# EasyEDA Pro project V3P驱动板最新版原PCB.epro

# Board V3pro_PCB_4.0
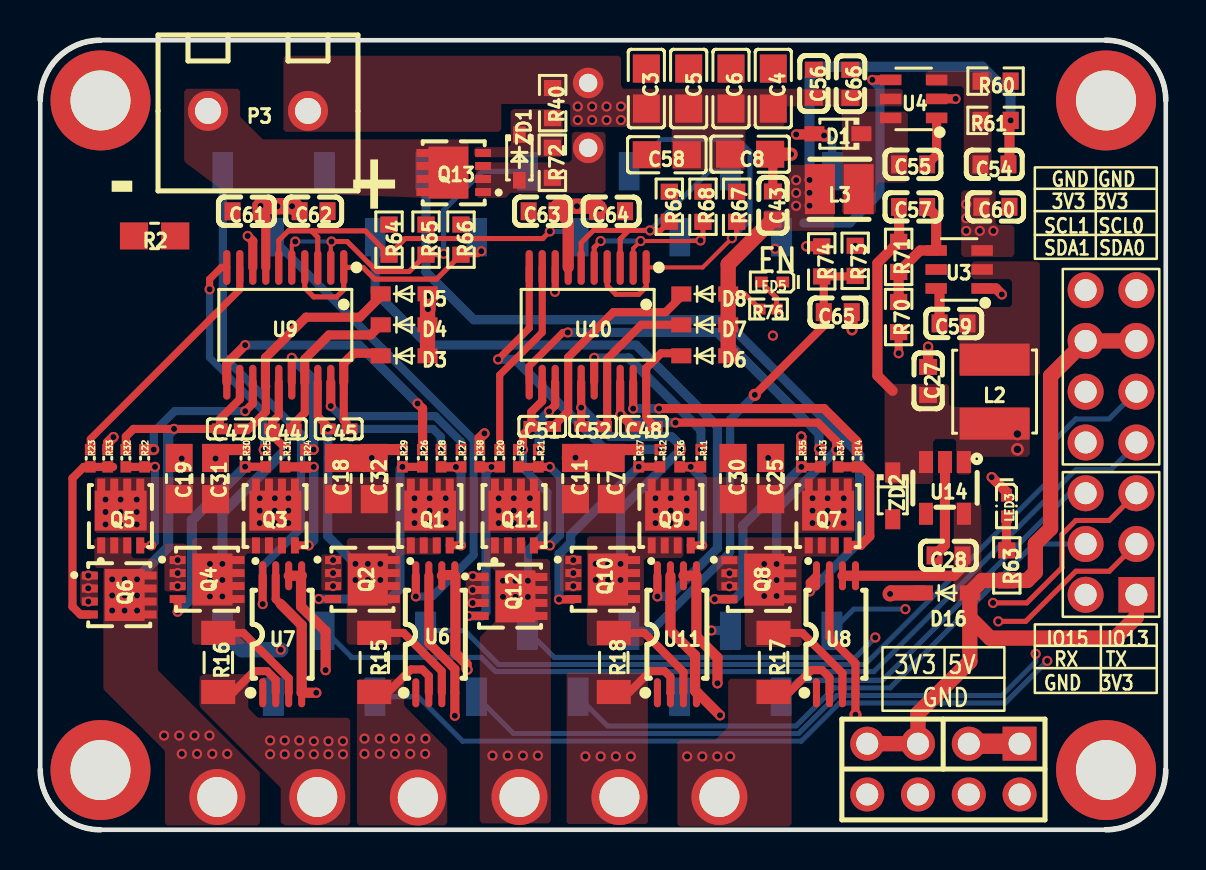
[diagram p0: board, top side]
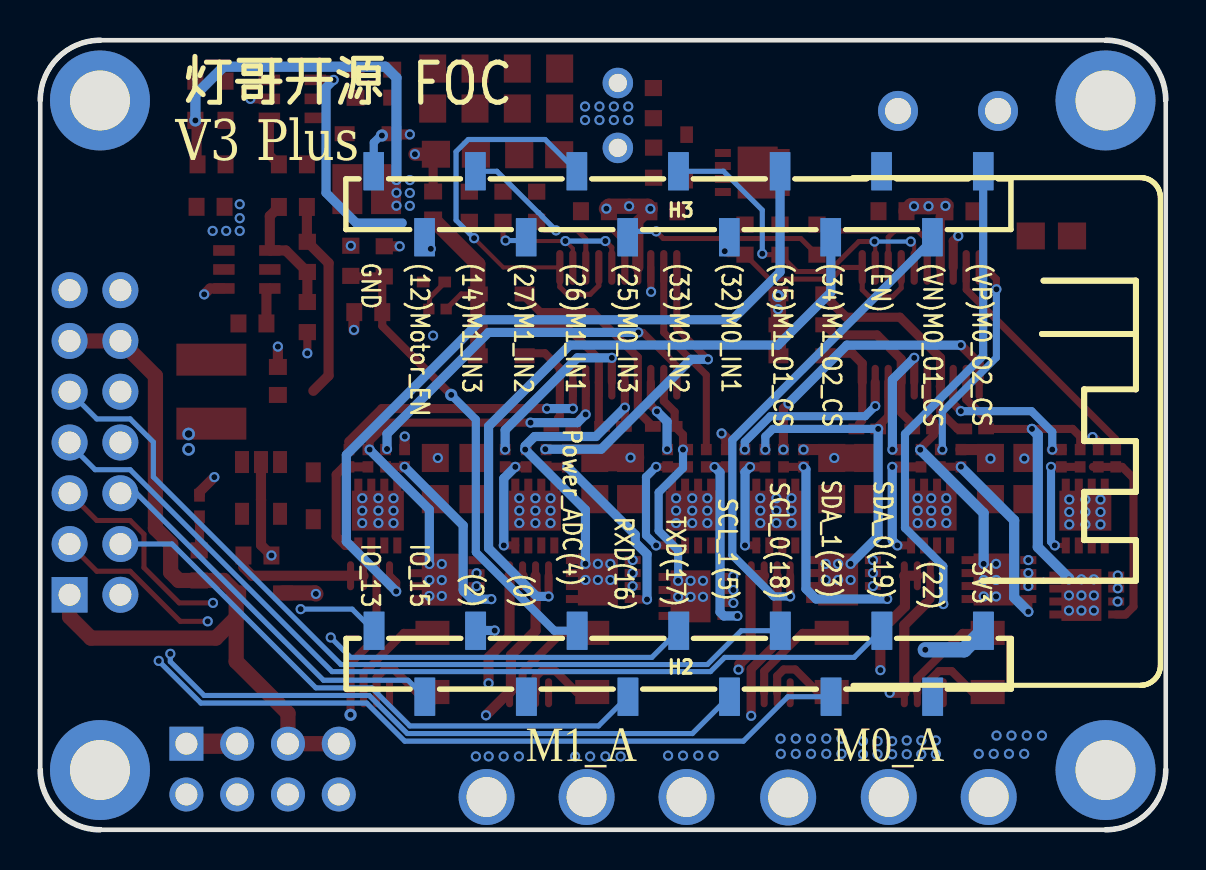
[diagram p1: board, bottom side, seen from below]

Outline 56.32 x 39.52 mm; copper layers: Top Layer, 内层1, 内层2, Bottom Layer. Coordinates in mm from the lower left corner of the outline.
Outline path: 0,36.52 arc(0.88,38.64) 3,39.52 53.29,39.52 arc(55.42,38.64) 56.29,36.52 56.29,3.03 arc(55.42,0.9) 53.29,0.03 3,0.03 arc(0.88,0.9) 0,3.03 0,36.52 ; 0.03,36.5 arc(0.9,38.62) 3.03,39.5 53.32,39.5 arc(55.44,38.62) 56.32,36.5 56.32,3 arc(55.44,0.88) 53.32,0 3.03,0 arc(0.9,0.88) 0.03,3 0.03,36.5
Stack: Top Layer 0.035mm 外层铜厚1oz / Dielectric1 0.2104mm 7628 RC49% 8.6mil / 内层1 0.035mm / Dielectric2 1.065mm 1.1mm H/HOZ Copper / 内层2 0.035mm / Dielectric3 0.2104mm 7628 RC49% 8.6mil / Bottom Layer 0.035mm 外层铜厚1oz

## Design rules (mm)
template: JLCPCB Capability(Two Layers Board)
spacing copperThickness1oz (default): track to track 0.102, other pairs 0.152 to 0.3
spacing copperThickness2oz: track to track 0.203, other pairs 0.152 to 0.3
track width copperThickness1oz (default): min 0.127, default 0.254, max 2.54
track width copperThickness2oz: min 0.203, default 0.254, max 2.54
differential pair differentialPair (default): width min 0.127, default 0.254, max 2.54; gap min 0.152, default 0.152
via viaSize (default): diameter min 0.5, default 0.61, max 10; hole min 0.3, default 0.305, max 6.3

## Placement (name value [footprint] x y rotation side)
C3  4.7uF  [C0805]  30.33 37.09 90 top
C4  4.7uF  [C0805]  36.68 37.09 90 top
C5  4.7uF  [C0805]  32.44 37.09 90 top
C6  4.7uF  [C0805]  34.56 37.09 90 top
C7  10uF  [0805]  28.57 17.58 270 top
C8  4.7uF  [C0805]  35.52 33.81 0 top
C11  10uF  [0805]  26.78 17.58 270 top
C18  10uF  [0805]  14.92 17.58 270 top
C19  10uF  [0805]  6.96 17.58 270 top
C25  10uF  [0805]  36.55 17.58 270 top
C27  10uF  [C0603]  44.42 22.47 270 top
C28  1uF  [C0603]  45.44 13.73 0 top
C30  10uF  [0805]  34.67 17.58 270 top
C31  10uF  [0805]  8.78 17.58 270 top
C32  10uF  [0805]  16.72 17.58 270 top
C43  10uF  [C0603]  36.66 31.24 270 top
C44  1uF  [C0402]  12.15 20.07 180 top
C45  1uF  [C0402]  14.94 20.07 180 top
C47  1uF  [C0402]  9.54 20.07 180 top
C48  1uF  [C0402]  30.2 20.19 180 top
C51  1uF  [C0402]  25.12 20.19 180 top
C52  1uF  [C0402]  27.66 20.19 180 top
C54  47pf  [C0603]  47.74 33.3 0 top
C55  100nF  [C0603]  43.67 33.3 0 top
C56  100nF  [C0603]  38.7 37.34 270 top
C57  47pf  [C0603]  43.67 31.17 0 top
C58  4.7uF  [C0805]  31.35 33.78 180 top
C59  100nF  [C0603]  45.69 25.34 180 top
C60  100nF  [C0603]  47.79 31.18 180 top
C61  100nF  [C0603]  10.33 30.95 0 top
C62  1uf  [C0603]  13.68 30.96 180 top
C63  100nF  [C0603]  25.14 30.95 0 top
C64  1 uf  [C0603]  28.56 30.96 180 top
C65  100nF  [C0603]  39.9 25.91 180 top
C66  1uf  [C0603]  40.53 37.33 270 top
D1  1N5819WS  [SOD-323_L1.8-W1.3-LS2.5-RD]  39.91 34.83 180 top
D3  1N5819WS  [SOD-323_L1.8-W1.3-LS2.5-RD]  18.21 23.72 0 top
D4  1N5819WS  [SOD-323_L1.8-W1.3-LS2.5-RD]  18.21 25.27 0 top
D5  1N5819WS  [SOD-323_L1.8-W1.3-LS2.5-RD]  18.21 26.82 0 top
D6  1N5819WS  [SOD-323_L1.8-W1.3-LS2.5-RD]  33.25 23.72 0 top
D7  1N5819WS  [SOD-323_L1.8-W1.3-LS2.5-RD]  33.25 25.27 0 top
D8  1N5819WS  [SOD-323_L1.8-W1.3-LS2.5-RD]  33.25 26.82 0 top
D16  1N5819WS  [SOD-323_L1.8-W1.3-LS2.5-RD]  45.33 11.86 0 top
H2  -  [SMD,P=2.54mm(交错脚)]  25.63 8.38 270 bottom
H3  -  [SMD,P=2.54mm(交错脚)]  25.65 31.37 270 bottom
L2  10uH  [IND-SMD_L4.0-W4.0]  47.75 21.93 270 top
L3  6.8uH  [IND-SMD_L2.5-W2.0_SPH252012]  39.98 32.06 180 top
LED3  TZ-P2-0402GTIA1-0.45T  [LED0402-RD]  48.34 16.21 270 top
LED5  TZ-P2-0402GTIA1-0.45T  [LED0402-RD]  36.62 27.41 180 top
NOREF  -  [Pad_e349]  52.3 27.01 0 top
NOREF#2  -  [Pad_e383]  49 1.78 0 top
NOREF#3  -  [Pad_e2956]  23.98 1.65 180 top
NOREF#4  -  [Pad_e352]  52.3 24.47 0 top
NOREF#5  -  [Pad_e2952]  8.87 1.65 180 top
NOREF#6  -  [Pad_e360]  52.3 14.31 0 top
NOREF#7  -  [Pad_e369]  41.38 4.32 0 top
NOREF#8  -  [Pad_e2950]  3.03 36.5 270 top
NOREF#9  -  [Pad_e357]  54.84 19.39 0 top
NOREF#10  -  [Pad_e43]  27.42 34.12 0 top
NOREF#11  -  [Pad_e386]  49 4.32 0 top
NOREF#12  -  [Pad_e359]  54.84 16.85 0 top
NOREF#13  -  [Pad_e365]  54.84 11.77 90 top
NOREF#14  -  [Pad_e354]  52.3 21.93 0 top
NOREF#15  -  [Pad_e17]  27.42 37.37 0 top
NOREF#16  -  [Pad_e350]  54.84 27.01 0 top
NOREF#17  -  [Pad_e358]  52.3 16.85 0 top
NOREF#18  -  [Pad_e361]  54.84 14.31 0 top
NOREF#19  -  [Pad_e2959]  33.98 1.65 180 top
NOREF#20  -  [Pad_e2951]  3.03 3 270 top
NOREF#21  -  [Pad_e356]  52.3 19.39 0 top
NOREF#22  -  [Pad_e2953]  13.87 1.65 180 top
NOREF#23  -  [Pad_e374]  46.46 4.32 0 top
NOREF#24  -  [Pad_e373]  43.92 4.32 0 top
NOREF#25  -  [Pad_e382]  46.46 1.78 0 top
NOREF#26  -  [Pad_e362]  52.3 11.77 0 top
NOREF#27  -  [Pad_e355]  54.84 21.93 0 top
NOREF#28  -  [Pad_e2960]  53.32 36.5 270 top
NOREF#29  -  [Pad_e375]  41.38 1.78 0 top
NOREF#30  -  [Pad_e353]  54.84 24.47 0 top
NOREF#31  -  [Pad_e381]  43.92 1.78 0 top
NOREF#32  -  [Pad_e2958]  28.98 1.65 180 top
NOREF#33  -  [Pad_e1459]  18.9 1.63 180 top
NOREF#34  -  [Pad_e2961]  53.32 3 270 top
P3  WJ126V-5.0-2P  [CONN-TH_WJ126V-5.0-2P]  10.9 35.97 270 top
Q1  WSD4070DN  [PDFN3333-8_L3.1-W3.2-P0.65-LS3.4-BL]  19.52 15.71 0 top
Q2  WSD4070DN  [PDFN3333-8_L3.1-W3.2-P0.65-LS3.4-BL]  16.13 12.53 270 top
Q3  WSD4070DN  [PDFN3333-8_L3.1-W3.2-P0.65-LS3.4-BL]  11.78 15.71 0 top
Q4  WSD4070DN  [PDFN3333-8_L3.1-W3.2-P0.65-LS3.4-BL]  8.36 12.53 270 top
Q5  WSD4070DN  [PDFN3333-8_L3.1-W3.2-P0.65-LS3.4-BL]  4.04 15.71 0 top
Q6  WSD4070DN  [PDFN3333-8_L3.1-W3.2-P0.65-LS3.4-BL]  3.96 11.76 270 top
Q7  WSD4070DN  [PDFN3333-8_L3.1-W3.2-P0.65-LS3.4-BL]  39.42 15.71 0 top
Q8  WSD4070DN  [PDFN3333-8_L3.1-W3.2-P0.65-LS3.4-BL]  35.95 12.52 270 top
Q9  WSD4070DN  [PDFN3333-8_L3.1-W3.2-P0.65-LS3.4-BL]  31.57 15.71 0 top
Q10  WSD4070DN  [PDFN3333-8_L3.1-W3.2-P0.65-LS3.4-BL]  28.15 12.53 270 top
Q11  WSD4070DN  [PDFN3333-8_L3.1-W3.2-P0.65-LS3.4-BL]  23.73 15.71 0 top
Q12  WSD4070DN  [PDFN3333-8_L3.1-W3.2-P0.65-LS3.4-BL]  23.51 11.68 270 top
Q13  WSD4070DN  [PDFN3333-8_L3.1-W3.2-P0.65-LS3.4-BL]  20.69 32.89 90 top
R2  0  [0805]  5.73 29.72 0 top
R11  2.2Ω  [0402]  33.05 18.6 270 top
R12  2.2Ω  [0402]  31 18.6 270 top
R13  2.2Ω  [0402]  39.03 18.6 270 top
R14  2.2Ω  [0402]  40.87 18.6 270 top
R15  0.01  [R1206]  16.72 8.38 270 top
R16  0.01  [R1206]  8.92 8.38 270 top
R17  0.01  [R1206]  36.69 8.38 270 top
R18  0.01  [R1206]  28.7 8.38 270 top
R20  2.2Ω  [0402]  22.99 18.6 270 top
R21  2.2Ω  [0402]  24.93 18.6 270 top
R22  2.2Ω  [0402]  5.23 18.6 270 top
R23  2.2Ω  [0402]  2.51 18.6 270 top
R24  2.2Ω  [0402]  13.28 18.59 270 top
R25  2.2Ω  [0402]  11.29 18.6 270 top
R26  2.2Ω  [0402]  19.13 18.6 270 top
R27  2.2Ω  [0402]  21.06 18.6 270 top
R28  10kΩ  [R0402]  20.06 18.6 90 top
R29  10kΩ  [R0402]  18.13 18.6 90 top
R30  10kΩ  [R0402]  10.26 18.6 90 top
R31  10kΩ  [R0402]  12.25 18.6 90 top
R32  10kΩ  [R0402]  4.29 18.6 90 top
R33  10kΩ  [R0402]  3.39 18.6 90 top
R34  10kΩ  [R0402]  39.92 18.6 90 top
R35  10kΩ  [R0402]  38.08 18.6 90 top
R36  10kΩ  [R0402]  32 18.6 90 top
R37  10kΩ  [R0402]  29.95 18.6 90 top
R38  10kΩ  [R0402]  21.99 18.6 90 top
R39  10kΩ  [R0402]  23.93 18.6 90 top
R40  1k  [R0603]  25.64 36.36 90 top
R60  10K  [R0603]  47.79 37.47 180 top
R61  120K  [R0603]  47.79 35.5 0 top
R63  1K  [R0603]  48.36 13.24 90 top
R64  10K  [R0603]  17.46 29.53 90 top
R65  10K  [R0603]  19.31 29.53 90 top
R66  10K  [R0603]  21.06 29.53 90 top
R67  10K  [R0603]  34.84 31.18 90 top
R68  10K  [R0603]  33.16 31.18 90 top
R69  10K  [R0603]  31.47 31.18 90 top
R70  10K  [R0603]  42.95 25.66 270 top
R71  75K  [R0603]  42.95 28.67 270 top
R72  10K  [R0603]  25.63 33.38 90 top
R73  100K  [R0603]  40.77 28.47 90 top
R74  10K  [R0603]  39.1 28.45 270 top
R76  10kΩ  [R0402]  36.44 26.06 0 top
U2  micropython esp32  [MICROPYTHON ESP32]  25.65 19.81 270 bottom
U3  TPS54302DDCR  [SOT-23-6_L2.9-W1.6-P0.95-LS2.8-BL]  45.97 28.04 90 top
U4  BL9342  [SOT-23-6_L2.9-W1.6-P0.95-LS2.8-BL]  43.7 36.58 90 top
U6  INA240A2PWR  [TSSOP-8_L4.4-W3.0-P0.65-LS6.4-BL]  19.77 9.79 0 top
U7  INA240A2PWR  [TSSOP-8_L4.4-W3.0-P0.65-LS6.4-BL]  12.11 9.79 0 top
U8  INA240A2PWR  [TSSOP-8_L4.4-W3.0-P0.65-LS6.4-BL]  39.81 9.79 0 top
U9  FD6287T  [TSSOP-20_L6.5-W4.4-P0.65-LS6.4-BL]  12.27 25.27 180 top
U10  FD6287T  [TSSOP-20_L6.5-W4.4-P0.65-LS6.4-BL]  27.39 25.27 180 top
U11  INA240A2PWR  [TSSOP-8_L4.4-W3.0-P0.65-LS6.4-BL]  31.86 9.79 0 top
U14  XC6210B332MR  [TSOT-23-5_L2.9-W1.6-P0.95-LS2.8-BR]  45.26 17.11 90 top
ZD1  BZT52C12S  [SOD-323_L1.7-W1.3-LS2.6-RD]  23.98 33.65 270 top
ZD2  BZT52C5V6S  [SOD-323_L1.8-W1.3-LS2.5-RD]  42.65 16.72 270 top

## Footprints (pads in the part's own frame, mm; a bottom-side part is the same pattern mirrored in y, then rotated)
0402
  rect 0.566x0.54 smd: 1(-0.433,0) 2(0.433,0)
0805
  rect 1.41x1.35 smd: 1(-1.03,0) 2(1.03,0)
C0402
  rect 0.79x0.54 smd: 1(-0.545,0) 2(0.545,0)
C0603
  rect 0.8x0.9 smd: 1(-0.7,0) 2(0.7,0)
C0805
  rect 1.41x1.35 smd: 1(-1,0) 2(1,0)
CONN-TH_WJ126V-5.0-2P
  round 2 hole 1.3: 1(0,2.501) 2(0,-2.501)
IND-SMD_L2.5-W2.0_SPH252012
  rect 1.5x2.5 smd: 1(-0.969,0) 2(0.969,0)
IND-SMD_L4.0-W4.0
  rect 1.6x3.5 smd: 1(-1.6,0) 2(1.6,0)
LED0402-RD
  rect 0.636x0.54 smd: 1(-0.538,0) 2(0.538,0)
MICROPYTHON ESP32
  rect 1.9x1.02 smd: 1(-13.143,16.51) 2(-9.844,13.97) 3(-13.143,11.43) 4(-9.844,8.89) 5(-13.143,6.35) 6(-9.844,3.81) 7(-13.143,1.27) 8(-9.844,-1.27) 9(-13.143,-3.81) 10(-9.844,-6.35) 11(-13.143,-8.89) 12(-9.844,-11.43) 13(-13.143,-13.97) 14(9.844,16.51) 15(13.143,13.97) 16(9.844,11.43) 17(13.143,8.89) 18(9.844,6.35) 19(13.143,3.81) 20(9.844,1.27) 21(13.143,-1.27) 22(9.844,-3.81) 23(13.143,-6.35) 24(9.844,-8.89) 25(13.143,-11.43) 26(9.844,-13.97)
Pad_e17
  round 1.524 hole 0.914: 1(0,0)
Pad_e43
  round 1.524 hole 0.914: 1(0,0)
Pad_e349
  round 1.8 hole 1.1: 1(0,0)
Pad_e350
  round 1.8 hole 1.1: 2(0,0)
Pad_e352
  round 1.8 hole 1.1: 3(0,0)
Pad_e353
  round 1.8 hole 1.1: 4(0,0)
Pad_e354
  round 1.8 hole 1.1: 5(0,0)
Pad_e355
  round 1.8 hole 1.1: 6(0,0)
Pad_e356
  round 1.8 hole 1.1: 7(0,0)
Pad_e357
  round 1.8 hole 1.1: 8(0,0)
Pad_e358
  round 1.8 hole 1.1: 9(0,0)
Pad_e359
  round 1.8 hole 1.1: 10(0,0)
Pad_e360
  round 1.8 hole 1.1: 11(0,0)
Pad_e361
  round 1.8 hole 1.1: 12(0,0)
Pad_e362
  round 1.8 hole 1.1: 13(0,0)
Pad_e365
  rect 1.778x1.8 hole 1.1: 1(0,0)
Pad_e369
  round 1.7 hole 1.1: 1(0,0)
Pad_e373
  round 1.7 hole 1.1: 2(0,0)
Pad_e374
  round 1.7 hole 1.1: 3(0,0)
Pad_e375
  round 1.7 hole 1.1: 4(0,0)
Pad_e381
  round 1.7 hole 1.1: 5(0,0)
Pad_e382
  round 1.7 hole 1.1: 6(0,0)
Pad_e383
  round 1.7 hole 1.1: 7(0,0)
Pad_e386
  rect 1.7x1.7 hole 1.1: 1(0,0)
Pad_e1459
  round 2.8 hole 2: 1(0,0)
Pad_e2950
  round 5 hole 3: N(0,0)
Pad_e2951
  round 5 hole 3: N(0,0)
Pad_e2952
  round 2.8 hole 2: 1(0,0)
Pad_e2953
  round 2.8 hole 2: 1(0,0)
Pad_e2956
  round 2.8 hole 2: 1(0,0)
Pad_e2958
  round 2.8 hole 2: 1(0,0)
Pad_e2959
  round 2.8 hole 2: 1(0,0)
Pad_e2960
  round 5 hole 3: N(0,0)
Pad_e2961
  round 5 hole 3: N(0,0)
PDFN3333-8_L3.1-W3.2-P0.65-LS3.4-BL
  rect 0.4x0.8 smd: 1(-0.975,-1.47) 2(-0.325,-1.47) 3(0.325,-1.47) 4(0.975,-1.47) 5(0.975,1.47) 6(0.325,1.47) 7(-0.325,1.47) 8(-0.975,1.47)
  rect 2.6x2 smd: 9(-0.004,0.27)
R0402
  rect 0.566x0.54 smd: 1(-0.433,0) 2(0.433,0)
R0603
  rect 0.806x0.864 smd: 1(-0.753,0) 2(0.753,0)
R1206
  rect 1.208x1.701 smd: 1(-1.479,0) 2(1.479,0)
SMD,P=2.54mm(交错脚)
  rect 1.9x1.02 smd: 1(-1.587,16.51) 2(1.714,13.97) 3(-1.587,11.43) 4(1.714,8.89) 5(-1.587,6.35) 6(1.714,3.81) 7(-1.587,1.27) 8(1.714,-1.27) 9(-1.587,-3.81) 10(1.714,-6.35) 11(-1.587,-8.89) 12(1.714,-11.43) 13(-1.587,-13.97)
SOD-323_L1.7-W1.3-LS2.6-RD
  rect 0.83x0.63 smd: 1(-1.14,0) 2(1.14,0)
SOD-323_L1.8-W1.3-LS2.5-RD
  rect 1x0.75 smd: 1(-1.173,0) 2(1.173,0)
SOT-23-6_L2.9-W1.6-P0.95-LS2.8-BL
  rect 0.532x1.072 smd: 1(-0.95,-1.149) 2(0,-1.149) 3(0.95,-1.149) 4(0.95,1.149) 5(0,1.149) 6(-0.95,1.149)
TSOT-23-5_L2.9-W1.6-P0.95-LS2.8-BR
  rect 1.1x0.7 smd: 1(1.294,-0.951) 2(1.294,-0.001) 3(1.294,0.951) 4(-1.294,0.951) 5(-1.294,-0.949)
TSSOP-8_L4.4-W3.0-P0.65-LS6.4-BL
  oval 0.353x1.454 smd: 1(-0.975,-2.927) 2(-0.325,-2.927) 3(0.325,-2.927) 4(0.975,-2.927) 5(0.975,2.927) 6(0.325,2.927) 7(-0.325,2.927) 8(-0.975,2.927)
TSSOP-20_L6.5-W4.4-P0.65-LS6.4-BL
  oval 0.364x1.742 smd: 1(-2.925,-2.871) 2(-2.275,-2.871) 3(-1.625,-2.871) 4(-0.975,-2.871) 5(-0.325,-2.871) 6(0.325,-2.871) 7(0.975,-2.871) 8(1.625,-2.871) 9(2.275,-2.871) 10(2.925,-2.871) 11(2.925,2.871) 12(2.275,2.871) 13(1.625,2.871) 14(0.975,2.871) 15(0.325,2.871) 16(-0.325,2.871) 17(-0.975,2.871) 18(-1.625,2.871) 19(-2.275,2.871) 20(-2.925,2.871)

## Nets
3V3: C28.2 D16.2 NOREF#4.3 NOREF#7.1 NOREF#13.1 NOREF#24.2 NOREF#30.4 R63.1 U6.5 U6.6 U7.5 U7.6 U8.5 U8.6 U11.5 U11.6 U14.5
5V: C27.2 C57.1 L2.2 NOREF#11.1 NOREF#23.3 R71.1 U14.1 U14.3 ZD2.1
10V: C43.2 C54.2 C61.2 C62.2 C63.2 C64.2 D3.2 D4.2 D5.2 D6.2 D7.2 D8.2 L3.2 R61.2 R76.1 U9.7 U10.7
GND: C3.2 C4.2 C5.2 C6.2 C8.2 C27.1 C28.1 C43.1 C56.1 C58.2 C60.1 C61.1 C62.1 C63.1 C64.1 C65.1 C66.1 D1.2 H3.13 LED3.1 LED5.1 NOREF.1 NOREF#2.7 NOREF#10.1 NOREF#16.2 NOREF#25.6 NOREF#26.13 NOREF#28.N NOREF#29.4 NOREF#31.5 NOREF#34.N Q13.1 Q13.2 Q13.3 R2.2 R60.1 R64.2 R65.2 R66.2 R67.2 R68.2 R69.2 R70.2 R72.1 R74.1 U2.13 U3.1 U4.2 U6.4 U6.7 U7.4 U7.7 U8.4 U8.7 U9.8 U10.8 U11.4 U11.7 U14.2 ZD1.2 ZD2.2
PGND: C7.1 C11.1 C18.1 C19.1 C25.1 C30.1 C31.1 C32.1 NOREF#8.N NOREF#20.N Q2.1 Q2.2 Q2.3 Q4.1 Q4.2 Q4.3 Q6.1 Q6.2 Q6.3 Q8.1 Q8.2 Q8.3 Q10.1 Q10.2 Q10.3 Q12.1 Q12.2 Q12.3 R2.1 R29.2 R30.2 R33.2 R35.2 R37.2 R38.2
VIN: C3.1 C4.1 C5.1 C6.1 C7.2 C8.1 C11.2 C18.2 C19.2 C25.2 C30.2 C31.2 C32.2 C56.2 C58.1 C60.2 C66.2 NOREF#15.1 P3.1 Q1.5 Q1.6 Q1.7 Q1.8 Q1.9 Q3.5 Q3.6 Q3.7 Q3.8 Q3.9 Q5.5 Q5.6 Q5.7 Q5.8 Q5.9 Q7.5 Q7.6 Q7.7 Q7.8 Q7.9 Q9.5 Q9.6 Q9.7 Q9.8 Q9.9 Q11.5 Q11.6 Q11.7 Q11.8 Q11.9 R40.2 R73.2 U3.3 U4.5
IO_13: H2.13 NOREF#12.10 U2.26
IO_15: H2.12 NOREF#17.9 U2.25
M0_GH1: R27.1 U9.19
M0_GH2: R24.1 U9.16
M0_GH3: R22.1 U9.13
M0_GL1: R26.1 U9.11
M0_GL2: R25.1 U9.10
M0_GL3: R23.1 U9.9
M0_IN1: H3.6 R66.1 U2.6 U9.1 U9.4
M0_IN2: H3.7 R65.1 U2.7 U9.2 U9.5
M0_IN3: H3.8 R64.1 U2.8 U9.3 U9.6
M0_OUT1_CS: H3.2 U2.2 U6.8
M0_OUT1_N: NOREF#33.1 R15.2 U6.2
M0_OUT1_P: C45.2 Q1.1 Q1.2 Q1.3 Q2.5 Q2.6 Q2.7 Q2.8 Q2.9 R15.1 R28.2 U6.3 U9.18
M0_OUT2_CS: H3.1 U2.1 U7.8
M0_OUT2_N: NOREF#22.1 R16.2 U7.2
M0_OUT2_P: C44.2 Q3.1 Q3.2 Q3.3 Q4.5 Q4.6 Q4.7 Q4.8 Q4.9 R16.1 R31.2 U7.3 U9.15
M0_OUT3: C47.2 NOREF#5.1 Q5.1 Q5.2 Q5.3 Q6.5 Q6.6 Q6.7 Q6.8 Q6.9 R32.2 U9.12
M1_GH1: R14.1 U10.19
M1_GH2: R11.1 U10.16
M1_GH3: R21.1 U10.13
M1_GL1: R13.1 U10.11
M1_GL2: R12.1 U10.10
M1_GL3: R20.1 U10.9
M1_IN1: H3.9 R67.1 U2.9 U10.1 U10.4
M1_IN2: H3.10 R68.1 U2.10 U10.2 U10.5
M1_IN3: H3.11 R69.1 U2.11 U10.3 U10.6
M1_OUT1_CS: H3.5 U2.5 U8.8
M1_OUT1_N: NOREF#19.1 R17.2 U8.2
M1_OUT1_P: C48.2 Q7.1 Q7.2 Q7.3 Q8.5 Q8.6 Q8.7 Q8.8 Q8.9 R17.1 R34.2 U8.3 U10.18
M1_OUT2_CS: H3.4 U2.4 U11.8
M1_OUT2_N: NOREF#32.1 R18.2 U11.2
M1_OUT2_P: C52.2 Q9.1 Q9.2 Q9.3 Q10.5 Q10.6 Q10.7 Q10.8 Q10.9 R18.1 R36.2 U10.15 U11.3
M1_OUT3: C51.2 NOREF#3.1 Q11.1 Q11.2 Q11.3 Q12.5 Q12.6 Q12.7 Q12.8 Q12.9 R39.2 U10.12
MOTOR_EN: H3.12 U2.12 U4.4
POWER_ADC: C65.2 H2.9 R73.1 R74.2 U2.22
RXD: H2.8 NOREF#6.11 U2.21
SCL_0: H2.5 NOREF#27.6 U2.18
SCL_1: H2.6 NOREF#14.5 U2.19
SDA_0: H2.3 NOREF#9.8 U2.16
SDA_1: H2.4 NOREF#21.7 U2.17
TXD: H2.7 NOREF#18.12 U2.20
$1N1813: Q7.4 R14.2 R34.1
$1N1814: Q8.4 R13.2 R35.1
$1N1815: Q9.4 R11.2 R36.1
$1N1816: Q10.4 R12.2 R37.1
$1N1817: Q12.4 R20.2 R38.1
$1N1818: Q11.4 R21.2 R39.1
$1N1819: Q6.4 R23.2 R33.1
$1N1820: Q5.4 R22.2 R32.1
$1N1821: Q4.4 R25.2 R30.1
$1N1822: Q3.4 R24.2 R31.1
$1N1823: Q2.4 R26.2 R29.1
$1N1824: Q1.4 R27.2 R28.1
$1N3545: Q13.4 R40.1 R72.2 ZD1.1
$1N3571: P3.2 Q13.5 Q13.6 Q13.7 Q13.8 Q13.9
$1N3819: C59.1 L2.1 U3.2
$1N3947: C59.2 U3.6
$1N4174: C57.2 R70.1 R71.2 U3.4
$1N4639: U3.5
$1N5187: C55.1 D1.1 L3.1 U4.6
$1N5204: C55.2 U4.1
$1N5456: C54.1 R60.2 R61.1 U4.3
$1N5899: LED3.2 R63.2
$1N6397: C44.1 D4.1 U9.17
$1N6400: C47.1 D5.1 U9.14
$1N6401: C45.1 D3.1 U9.20
$1N7278: C48.1 D6.1 U10.20
$1N7279: C51.1 D8.1 U10.14
$1N7282: C52.1 D7.1 U10.17
$1N41201: LED5.2 R76.2
$1N54448: D16.1 H2.1 U2.14

Pads without a net: H2 2 10 11; H3 3; U2 3 15 23 24; U6 1; U7 1; U8 1; U11 1; U14 4

## Via types
v1: diameter 0.508, hole 0.305, Top Layer to Bottom Layer, 283 vias
v2: diameter 0.61, hole 0.305, Top Layer to Bottom Layer, 5 vias
v3: diameter 0.635, hole 0.381, Top Layer to Bottom Layer, 2 vias

## Routing (per net, layer and track width the routed paths; a pad name or vN(x,y) marks a point on that pad's centre or on a via; arc(x,y) is an arc through that point)
3V3: length 93.7
  Top Layer w0.508: 20.1,12.72 20.13,12.75 20.71,12.75 20.78,12.69 20.78,8.85 21.33,8.3 21.33,8.07 v1(21.38,8.02) ; 32.18,12.72 32.83,12.72 32.83,9.69 33.88,8.64 v1(33.88,7.34) ; 40.14,12.72 45.71,12.72 46.14,13.15 C28.2 ; 12.44,12.72 13.09,12.72 13.06,12.69 13.06,11.18 14.29,9.95 v1(14.29,8)
  Top Layer w0.762: 43.92,5.84 46.51,8.43 46.51,10.62 ; NOREF#7.1 NOREF#24.2 43.92,5.84 ; 46.51,10.62 47.52,9.6 53.77,9.6 54.84,10.67 NOREF#13.1 ; 46.51,10.62 D16.2 47.13,12.48 R63.1 49.38,12.48 49.78,12.89 49.78,14.32 50.55,15.08 50.55,22.71 NOREF#4.3 NOREF#30.4
  内层1 w0.762: v1(14.29,8) 21.36,8 v1(21.38,8.02) 33.2,8.02 v1(33.88,7.34) 36.91,4.32 NOREF#7.1
5V: length 28.1
  Top Layer w0.508: 42.65,21.97 41.88,22.73 41.88,28.36 R71.1 ; 42.97,29.45 C57.1
  Top Layer w1.016: NOREF#23.3 NOREF#11.1
  内层1 w1.016: 49.12,4.32 48.89,4.55 v3(48.89,19.04) v3(48.89,19.81)
10V: length 48.2
  Top Layer w0.254: R76.1 35.25,26.82 D8.2
  Top Layer w0.457: U9.7 11.29,30.69 C61.2
  Top Layer w0.508: 48.49,33.27 48.49,35.31 48.55,35.36 v2(48.55,35.5)
  Top Layer w0.559: v1(25.79,31.08) 26.42,30.45 U10.7
  Top Layer w0.762: 34.42,23.85 D7.2 D8.2 34.42,28.31 C43.2 ; 19.38,23.85 D4.2 19.38,26.7 v2(19.41,26.72) v1(19.41,26.06) ; v1(25.79,31.08) 25.92,31.21 v1(26.85,31.21) 27.87,31.21 v1(27.99,31.08)
  Top Layer w0.813: v1(11.03,31.23) 11.05,31.21 v1(11.88,31.21) v1(12.6,31.21) 12.73,31.21 C62.2
  内层1 w0.762: v1(19.41,26.06) v2(19.41,26.72) 19.41,31.24
  Bottom Layer w0.508: v1(38.49,32.52) 38.49,37.63 39.05,38.19 47.13,38.19 48.55,36.77 v2(48.55,35.5)
  vias: v1(37.82,32.51) v1(37.82,31.87) v1(37.82,31.23) v1(38.49,31.88) v1(38.49,31.23)
GND: length 80.5
  Top Layer w0.355: 25.77,28.14 25.77,26.94 v1(25.76,26.92)
  Top Layer w0.406: 12.04,11.3 11.79,11.55 11.79,12.72 ; v1(42.95,23.85) R70.2 ; v2(40.79,5.77) U8.4 40.79,8.34 39.49,9.64 39.49,12.72
  Top Layer w0.457: v1(10.39,29.72) 10.64,29.46 U9.8 ; C43.1 36.66,33.76 36.68,33.78 ; 19.45,12.72 19.45,9.36 20.75,8.06 U6.4 v1(20.75,5.72) ; U4.2 v1(45.8,36.58)
  Top Layer w0.508: LED3.1 48.34,16.91 v1(47.6,17.65) ; D1.2 38.7,34.8 v1(37.82,34.8) ; 12.04,11.3 13.09,10.25 13.09,6.87 v1(13.82,6.87) ; 31.53,12.72 31.53,11.97 31.54,11.96 31.54,11.41 31.53,11.4 31.53,9.97 32.76,8.74 32.76,6.96 32.86,6.87 ; 32.86,6.87 32.88,6.87 v1(34.01,5.74) ; 32.86,6.87 U11.4 ; U3.1 47.81,27.09 v1(48.11,26.8) ; C27.1 v1(44.42,24.18) ; v1(44.74,13.73) 45.26,14.26 45.26,16.51 45.27,16.51 U14.2 ; R74.1 v1(38.33,29.2)
  Top Layer w0.559: v1(40.61,25.02) 40.61,25.89 40.6,25.91
  Top Layer w0.66: C8.2 v1(37.57,33.81)
  内层1 w0.762: v1(13.82,6.87) 14.97,5.72 v1(20.75,5.72) 20.77,5.74 v1(34.01,5.74) 37.97,1.78 NOREF#29.4
  Bottom Layer w0.406: H3.13 39.62,34.39 39.22,34.8
  vias: v1(36.66,24.73) v2(39.22,34.74)
PGND: length 10.7
  Top Layer w0.508: 21.99,19.03 21.99,19.6 v1(22.23,19.84) ; v1(3.67,19.66) 3.4,19.39 3.4,19.05 3.39,19.03 ; 38.08,19.03 38.08,19.68 v1(38.07,19.69)
  Top Layer w0.559: v1(18.13,19.03) 17.01,19.03 v1(16.59,18.61) ; 29.95,19.03 28.86,19.03 28.44,18.61 ; 10.26,19.03 9.23,19.03 v1(8.78,18.58)
  Top Layer w1.371: v1(26.78,18.63) 28.43,18.63 28.44,18.61 ; v1(16.59,18.61) C18.1
  vias: v1(2.41,12.73) v1(2.41,12.09) v1(2.42,11.43) v1(6.89,13.5) v1(6.89,12.85) v1(6.89,12.2) v1(7.09,18.58) v1(14.66,13.5) v1(14.66,12.85) v1(14.66,12.2) v1(21.65,12.7) v1(21.64,12.01) v1(21.64,11.36) v1(26.68,13.5) v1(26.68,12.85) v1(26.68,12.2) v1(34.48,12.85) v1(34.48,12.2) v1(36.42,18.61)
VIN:
  vias: v1(3.28,16.53) v1(3.28,15.91) v1(3.28,15.29) v1(4.03,16.53) v1(4.03,15.91) v1(4.03,15.29) v1(4.84,16.53) v1(4.84,15.91) v1(4.84,15.29) v1(10.99,16.6) v1(10.99,15.98) v1(10.99,15.35) v1(11.75,16.6) v1(11.75,15.98) v1(11.75,15.35) v1(12.42,16.6) v1(12.42,15.98) v1(12.42,15.35) v1(18.73,16.6) v1(18.73,15.98) v1(18.73,15.35) v1(19.49,16.6) v1(19.49,15.98) v1(19.49,15.35) v1(20.29,16.6) v1(20.29,15.98) v1(20.29,15.35) v1(22.94,16.6) v1(22.94,15.98) v1(22.94,15.35) v1(23.7,16.6) v1(23.7,15.98) v1(23.7,15.35) v1(24.5,16.6) v1(24.5,15.98) v1(24.5,15.35) v1(26.9,36.2) v1(26.9,35.52) v1(27.62,36.2) v1(27.62,35.52) v1(28.34,36.2) v1(28.34,35.52) v1(29.06,36.2) v1(29.06,35.52) v1(30.78,16.6) v1(30.78,15.98) v1(30.78,15.35) v1(31.54,16.6) v1(31.54,15.98) v1(31.54,15.35) v1(32.35,16.6) v1(32.35,15.98) v1(32.35,15.35) v1(38.64,16.6) v1(38.64,15.98) v1(38.64,15.35) v1(39.39,16.6) v1(39.39,15.98) v1(39.39,15.35) v1(40.2,16.6) v1(40.2,15.98) v1(40.2,15.35) v1(40.77,29.23) v1(46.33,31.31) v1(46.33,30.61) v1(46.33,29.97) v1(47.01,29.97) v1(47.68,29.97)
(no net): length 1
  Bottom Layer w0.457: v1(33.58,9.98) 34.53,9.98 U2.24
IO_13: length 19
  Top Layer w0.254: NOREF#12.10 53.48,15.49 51.81,15.49 51.12,14.8 51.12,13.13 49.35,11.36 v1(47.67,11.36)
  内层1 w0.254: v1(43.28,11.05) 43.59,11.36 v1(47.67,11.36)
  Bottom Layer w0.254: v1(43.28,11.05) 40.7,11.05 U2.26
IO_15: length 19.4
  Bottom Layer w0.254: NOREF#17.9 51.49,16.85 42.14,7.49 37.91,7.49 U2.25
M0_GH1: length 8.8
  Top Layer w0.457: U9.19 v1(14.54,21.21)
  Bottom Layer w0.406: v1(14.54,21.21) 15.05,20.7 19.79,20.7 21.07,19.42 v1(21.07,19.03)
M0_GH2: length 6.7
  Top Layer w0.406: U9.16 v1(12.59,23.62)
  Top Layer w0.508: v1(13.68,19.03) 13.67,19.02 R24.1
  Bottom Layer w0.457: v1(12.59,23.62) 13.68,22.53 v1(13.68,19.03)
M0_GH3: length 7.9
  Top Layer w0.406: U9.13 10.64,21.34 v1(10.26,20.95)
  Top Layer w0.559: v1(5.69,19.03) 5.23,19.03
  Bottom Layer w0.406: v1(10.26,20.95) 6.73,20.95 5.69,19.91 v1(5.69,19.03)
M0_GL1: length 14.5
  Top Layer w0.457: U9.11 9.34,23.34 v1(10.26,24.26) ; v1(19.14,19.03) 19.14,21.08 v1(18.88,21.34)
  Bottom Layer w0.457: v1(10.26,24.26) 15.96,24.26 v1(18.88,21.34)
M0_GL2: length 10.7
  Top Layer w0.355: v1(8.48,27.05) 8.48,27.56 9.07,28.14 U9.10
  Bottom Layer w0.355: v1(8.48,27.05) 8.48,23.63 11.19,20.93 v1(11.19,19.03)
M0_GL3: length 12.2
  Top Layer w0.355: 2.51,19.03 2.51,19.56 9.99,27.04 U9.9
M0_IN1: length 12.1
  Top Layer w0.254: v1(22.07,28.96) 21.9,28.78 21.06,28.78 19.83,27.56 16.74,27.56 16.15,28.14 U9.1 15.19,27.03 14.83,26.67 13.69,26.67 13.24,27.12 U9.4
M0_IN2: length 18.3
  Top Layer w0.203: U9.5 12.59,29.27 v1(12.77,29.44) ; U9.2 14.54,29.4 v1(14.58,29.44)
  Top Layer w0.254: v1(14.58,29.44) 15.36,29.44 16.86,27.94 18.47,27.94 19.31,28.78 20.15,28.78 v1(20.19,28.83)
  Bottom Layer w0.203: v1(12.77,29.44) v1(14.58,29.44)
  Bottom Layer w0.254: H3.7 22.13,32.96 20.19,31.01 v1(20.19,28.83)
M0_IN3: length 19.6
  Top Layer w0.254: v1(25.5,29.95) 25.15,29.59 18.27,29.59 17.46,28.78 16.27,29.97 13.64,29.97 13.61,29.94 ; U9.3 13.89,29.65 13.61,29.94 ; 13.61,29.94 13.61,29.97 12.42,29.97 11.94,29.49 U9.6
  Bottom Layer w0.254: H3.8 26.63,29.95 v1(25.5,29.95)
M0_OUT1_CS: length 24.8
  Top Layer w0.406: 18.8,12.72 v1(18.8,11.68)
  Bottom Layer w0.406: H3.2 11.68,29.52 21.69,19.52 21.69,13.76 19.62,11.68 v1(18.8,11.68)
M0_OUT1_N: length 4.2
  Top Layer w0.406: R15.2 17.42,6.9 18.55,8.03 19.12,8.03 19.45,7.7 U6.2
  vias: v1(16.23,4.57) v1(16.23,3.81) v1(16.99,4.57) v1(16.99,3.81) v1(17.75,4.57) v1(17.75,3.81) v1(18.52,4.57) v1(18.52,3.81) v1(19.28,4.57) v1(19.27,3.81)
M0_OUT1_P: length 21.6
  Top Layer w0.406: U6.3 20.1,7.94 18.18,9.86 R15.1 ; U9.18 13.89,20.7 14.4,20.19 v1(14.4,20.07)
  Bottom Layer w0.406: v1(14.4,20.07) 19.66,20.07 20.04,19.69 20.04,19.05
  Bottom Layer w0.457: v1(15.78,13.31) 14.4,14.7 v1(14.4,20.07)
  vias: v1(15.78,12.51) v1(16.4,13.31) v1(16.4,12.51) v1(17.02,13.31) v1(17.02,12.51) v1(20.04,19.02)
M0_OUT2_CS: length 25.5
  Top Layer w0.406: 11.14,12.72 v1(11.14,11.3)
  Bottom Layer w0.406: v1(11.14,11.3) 11.14,13.2 13.06,15.11 13.06,19.81 9.14,23.73 H3.1
M0_OUT2_N: length 4.1
  Top Layer w0.406: U7.2 11.79,7.52 11.36,7.95 10.72,7.95 9.67,6.9 R16.2
  vias: v1(11.51,4.48) v1(11.51,3.79) v1(12.24,4.48) v1(12.24,3.79) v1(12.97,4.48) v1(12.97,3.79) v1(13.7,4.45) v1(13.7,3.79) v1(14.43,4.45) v1(14.43,3.79) v1(15.16,4.45) v1(15.16,3.79)
M0_OUT2_P: length 16
  Top Layer w0.406: v1(12.29,19.02) 12.29,19.08 11.6,19.77 C44.2 11.6,20.4 11.94,20.74 U9.15 ; 12.44,6.87 12.44,7.59 10.16,9.86 R16.1
  Bottom Layer w0.508: v1(12.29,19.02) 9.12,15.85 v1(9.12,13.31)
  vias: v1(8.5,13.31) v1(8.5,12.51) v1(8.5,11.68) v1(9.12,12.51) v1(9.12,11.68)
M0_OUT3: length 16.4
  Top Layer w0.406: U9.12 9.99,21.55 9,20.55 C47.2 v1(6.7,20.07) ; 4.29,19.03 4.29,19.69 4.67,20.07 6.58,20.07
  Bottom Layer w0.508: v1(4.85,12.54) 4.85,12.59 6.41,14.15 6.41,19.77 v1(6.71,20.07)
  vias: v1(3.61,12.54) v1(3.61,11.73) v1(3.61,10.98) v1(4.23,12.54) v1(4.23,11.73) v1(4.23,10.98) v1(4.85,11.73) v1(4.85,10.98) v1(6.2,4.73) v1(6.97,4.73) v1(7.09,3.81) v1(7.73,4.73) v1(7.86,3.81) v1(8.48,4.73) v1(8.62,3.81) v1(9.37,3.81)
M1_GH1: length 13.6
  Top Layer w0.406: U10.19 v1(29.67,21.08)
  Top Layer w0.457: 40.87,19.03 40.87,19.43 39.22,21.08 v1(30.96,21.08)
  Bottom Layer w0.457: v1(29.67,21.08) v1(30.96,21.08)
M1_GH2: length 9
  Top Layer w0.406: U10.16 v1(27.72,23.62)
  Bottom Layer w0.457: v1(33.05,19.03) 33.05,20.01 29.44,23.62 v1(27.72,23.62)
M1_GH3: length 3.7
  Top Layer w0.406: v1(25.46,20.94) 25.77,21.25 25.77,22.4
  Top Layer w0.457: 24.93,19.03 24.94,19.05 v1(24.95,19.05)
  Bottom Layer w0.457: v1(25.46,20.94) 24.95,20.43 v1(24.95,19.05)
M1_GL1: length 18.8
  Top Layer w0.355: U10.11 24.47,23.2 26.16,24.89 v1(26.4,24.89)
  Bottom Layer w0.457: v1(38.96,19.06) 38.96,19.81 33.88,24.89 v1(26.4,24.89)
M1_GL2: length 15.2
  Top Layer w0.355: v1(22.91,23.55) 24.47,25.1 U10.10
  Bottom Layer w0.457: v1(31.05,19.05) 28.25,19.05 23.76,23.55 v1(22.91,23.55)
M1_GL3: length 10
  Top Layer w0.355: 22.99,19.03 22.99,22.76 25.12,24.89 25.12,28.14 U10.9
M1_IN1: length 21.6
  Top Layer w0.203: U10.1 33.14,28.14 v1(34.61,29.61)
  Top Layer w0.254: 28.37,28.14 28.37,27.23 28.8,26.8 29.95,26.8 30.32,27.17 U10.1 ; v1(34.61,29.61) 34.84,29.85 R67.1
  Bottom Layer w0.254: H3.9 31.05,34.54 34.9,34.54 35.51,33.93 35.51,30.51 v1(34.61,29.61)
M1_IN2: length 10
  Top Layer w0.203: U10.2 29.67,29.09 v1(30.04,29.46) 33.01,29.46 v1(33.03,29.49)
  Top Layer w0.254: v1(33.03,29.49) 33.16,29.62 R68.1 ; v1(28.04,29.46) 27.72,29.14 U10.5
  Bottom Layer w0.254: v1(28.04,29.46) v1(30.04,29.46) ; H3.10 32.17,29.49 v1(33.03,29.49)
M1_IN3: length 13.4
  Top Layer w0.254: 29.45,30 29.02,29.56 U10.3 ; 29.45,30 27.69,30 27.07,29.38 27.07,28.14 ; 29.45,30 v1(30.51,30) 31.05,30 R69.1
  Bottom Layer w0.254: H3.11 33.47,32.96 31.4,30.88 31.38,30.88 31.22,30.72 31.22,30.7 v1(30.51,30)
M1_OUT1_CS: length 39.3
  Top Layer w0.406: 38.84,12.72 38.5,12.39 v1(38.5,11.94)
  Bottom Layer w0.457: v1(38.5,11.94) 41,14.43 41,18.77 34.23,25.53 21.69,25.53 19.3,27.91 H3.5
M1_OUT1_N: length 4.2
  Top Layer w0.406: R17.2 37.48,6.9 38.58,8 39.12,8 39.49,7.63 U8.2
  vias: v1(32.37,3.68) v1(33.13,3.68) v1(33.88,3.68) v1(34.52,3.68)
M1_OUT1_P: length 26.5
  Top Layer w0.406: v1(31.78,20.38) 38.9,20.38 39.83,19.45 v1(39.83,19.03) ; R17.1 38.12,9.86 40.14,7.84 40.14,6.87 ; U10.18 29.02,20.8 v1(29.03,20.79)
  Top Layer w0.457: v1(29.03,20.79) 29.06,20.79 C48.2
  Bottom Layer w0.457: v1(31.78,20.38) 29.44,20.38 v1(29.03,20.79) ; v1(39.83,19.03) 39.83,19.02 36.84,16.03 v1(36.84,13.31)
  vias: v1(36.22,13.31) v1(36.22,12.5) v1(36.22,11.71) v1(36.84,12.5) v1(36.84,11.71)
M1_OUT2_CS: length 33.8
  Top Layer w0.406: 30.88,12.72 v1(30.88,11.68)
  Bottom Layer w0.457: v1(30.88,11.68) 31.47,11.68 33.88,14.1 33.88,20.19 29.82,24.26 19.41,24.26 16.76,26.9 H3.4
M1_OUT2_N: length 4.2
  Top Layer w0.406: R18.2 29.48,6.9 30.53,7.95 31.24,7.95 31.53,7.66 31.53,6.87 U11.2
  vias: v1(27.28,3.68) v1(28.04,3.68) v1(28.8,3.68) v1(29.55,3.68)
M1_OUT2_P: length 20.5
  Top Layer w0.406: 27.07,22.4 v1(27.07,21.13) 27.07,20.24 C52.2 ; U11.3 32.18,7.91 30.23,9.86 R18.1
  Bottom Layer w0.457: v1(27.07,21.13) 28.51,19.69 31.58,19.69 32.05,19.21 v1(32.05,19.03) 29.04,16.02 v1(29.04,13.31)
  vias: v1(27.79,13.31) v1(27.79,12.51) v1(28.41,13.31) v1(28.41,12.51) v1(29.04,12.51)
M1_OUT3: length 11.2
  Top Layer w0.406: v1(24.16,19.03) 24.16,19.78 C51.2 24.58,20.92 25.12,21.46 U10.12
  Bottom Layer w0.406: v1(24.16,19.03) 24.16,18.11 25.37,16.89 25.37,14.97 24.4,14 v1(24.4,12.47)
  vias: v1(22.63,3.72) v1(23.16,12.47) v1(23.16,11.66) v1(23.39,3.72) v1(23.78,12.47) v1(23.78,11.66) v1(24.16,3.72) v1(24.4,11.66) v1(24.9,3.72)
MOTOR_EN: length 11.2
  Top Layer w0.457: U4.4 v1(41.63,37.53)
  Bottom Layer w0.457: 38.2,30.37 40.5,30.37 42.01,31.88 42.01,37.14 v1(41.63,37.53)
  vias: v1(36.77,29.08)
POWER_ADC: length 24.1
  Top Layer w0.406: v2(35.75,21.77) 39.2,25.22 C65.2 39.2,27.59 R74.2 40.75,27.69 R73.1
  Bottom Layer w0.406: U2.22 30.59,9.97 34.52,13.9 34.52,20.53 v2(35.75,21.77)
RXD: length 29.7
  Bottom Layer w0.254: NOREF#6.11 49.71,14.31 42.52,7.11 39.73,7.11 37.82,5.21 28.39,5.21 U2.21
SCL_0: length 42.9
  Bottom Layer w0.254: NOREF#27.6 53.48,20.57 51.81,20.57 50.65,19.4 50.65,17.66 41.27,8.28 22.94,8.28 21.25,9.97 U2.18
SCL_1: length 44.7
  内层1 w0.254: NOREF#14.5 49.8,19.43 v1(49.8,8.81)
  Bottom Layer w0.254: v1(49.8,8.81) 49.8,8.42 48.11,6.73 39.85,6.73 37.95,4.83 23.69,4.83 U2.19
SDA_0: length 46.3
  Bottom Layer w0.254: NOREF#9.8 54.84,19.3 53.56,18.03 51.81,18.03 41.71,7.92 22.78,7.92 22.07,8.64 15.6,8.64 14.26,9.97 U2.16
SDA_1: length 47.9
  内层1 w0.254: v1(50.38,8.46) 50.38,17.47 NOREF#21.7
  Bottom Layer w0.254: v1(50.38,8.46) 48.27,6.35 39.98,6.35 38.07,4.45 21.14,4.45 18.91,6.67 U2.17
TXD: length 33.4
  Top Layer w0.254: NOREF#18.12 53.48,12.95 51.81,12.95 49.3,10.44 v1(47.93,10.44)
  内层1 w0.254: v1(41.78,9.63) 42.59,10.44 v1(47.93,10.44)
  Bottom Layer w0.254: U2.20 25.72,8.64 40.78,8.64 v1(41.78,9.63)
$1N1813: length 6
  Top Layer w0.457: 39.96,18.17 41.12,18.17 41.5,17.78 41.5,14.69 41.05,14.24 40.53,14.24
$1N1814: length 10.6
  Top Layer w0.406: v1(33.75,11.55) 33.82,11.55 33.82,11.55 34.48,11.55 ; v1(38.08,18.17) 38.99,18.17
  Bottom Layer w0.457: v1(33.75,11.55) 34.7,11.55 34.71,11.56 34.75,11.56 35.12,11.93 35.12,11.97 35.15,12.01 35.15,15.24 v1(38.08,18.17)
$1N1815: length 5.8
  Top Layer w0.406: Q9.4 v1(33.12,14.24)
  Top Layer w0.457: R36.1 v1(32.54,18.17) R11.2
  Bottom Layer w0.457: v1(33.12,14.24) 33.12,17.59 v1(32.54,18.17)
$1N1816: length 10.1
  Top Layer w0.406: R12.2 31,18.17 v1(29.95,18.17) ; v1(25.96,11.53) 26.65,11.53 Q10.4
  Bottom Layer w0.457: v1(25.96,11.53) 25.96,13.8 26.54,14.38 26.54,14.77 v1(29.95,18.17)
$1N1817: length 9.9
  Top Layer w0.406: Q12.4 v1(21.44,10.71) ; v1(22.58,18.16) 22.99,18.16 R20.2
  Top Layer w0.457: v1(22.58,18.16) 22.57,18.17 R38.1
  Bottom Layer w0.457: v1(22.58,18.16) 22.31,17.89 22.31,10.9 22.11,10.71 v1(21.44,10.71)
$1N1818: length 6.5
  Top Layer w0.406: v1(25.5,18.17) R21.2 24.16,18.17 ; Q11.4 v1(25.5,14.24)
  Bottom Layer w0.406: v1(25.5,18.17) 26.01,17.66 26.01,14.75 v1(25.5,14.24)
$1N1819: length 9.7
  Top Layer w0.406: 3.66,18.17 R23.2 2.19,18.17 1.63,17.6 1.63,11.18 2.02,10.78 Q6.4
$1N1820: length 5.9
  Top Layer w0.254: Q5.4 v1(5.56,14.24)
  Top Layer w0.406: v1(5.75,18.17) R22.2 4.42,18.17
  Bottom Layer w0.406: v1(5.75,18.17) 5.75,14.43 v1(5.56,14.24)
$1N1821: length 10.1
  Top Layer w0.406: 11.06,18.17 11.05,18.17 v1(10.26,18.17) ; Q4.4 v1(6.89,10.92)
  Bottom Layer w0.508: v1(6.89,10.92) 7.59,11.63 7.59,15.49 10.26,18.16
$1N1822: length 6.2
  Top Layer w0.406: Q3.4 v1(13.44,14.24)
  Top Layer w0.457: R31.1 v1(13.69,18.17)
  Bottom Layer w0.457: v1(13.69,18.17) 13.69,14.49 v1(13.44,14.24)
$1N1823: length 11.9
  Top Layer w0.254: Q2.4 13.95,11.55 v1(13.94,11.56)
  Top Layer w0.406: v1(18.13,18.17) 18.88,18.17
  Bottom Layer w0.457: v1(18.13,18.17) 18.01,18.05 18.01,12.06 17.5,11.56 v1(13.94,11.56)
$1N1824: length 5.4
  Top Layer w0.406: Q1.4 v1(21.06,14.24)
  Top Layer w0.457: v1(20.8,18.16) 20.8,18.17 20.04,18.17
  Bottom Layer w0.457: v1(20.8,18.16) 21.06,17.91 v1(21.06,14.24)
$1N3947: length 1.8
  Top Layer w0.508: U3.6 44.99,26.92 C59.2
$1N4174: length 6.2
  Top Layer w0.508: R70.1 42.95,27.92 44.02,28.99 U3.4 44.82,30.72 C57.2
$1N5204: length 2.5
  Top Layer w0.457: C55.2 44.85,33.78 U4.1
$1N5899: length 1.7
  Top Layer w0.457: LED3.2 48.34,14.01 R63.2
$1N6397: length 8.2
  Top Layer w0.406: U9.17 13.24,20.87 12.69,20.32 C44.1
  Top Layer w0.457: D4.1 16.53,24.77 14.45,24.77 13.24,23.56 U9.17
$1N6400: length 11.5
  Top Layer w0.406: C47.1 10.44,20.07 11.29,20.92 U9.14
  Top Layer w0.457: 17.04,26.7 16,25.65 13.31,25.65 11.28,23.62 11.28,22.2 11.29,22.19
$1N6401: length 5.2
  Top Layer w0.406: 15.36,20.32 15.19,20.49 U9.20
  Top Layer w0.457: 17.04,23.85 15.7,23.85 15.19,23.35 U9.20
$1N7278: length 5.2
  Top Layer w0.406: C48.1 30.4,20.53 30.4,20.61 30.32,20.69 U10.20 30.32,23.11 31.06,23.85 32.08,23.85
$1N7279: length 10.7
  Top Layer w0.406: 32.08,26.69 31.3,25.91 28.68,25.91 26.42,23.65 U10.14 26.42,20.95 C51.1
$1N7282: length 7.9
  Top Layer w0.406: D7.1 30.07,25.27 28.37,23.57 28.37,20.36 C52.1
$1N41201: length 1.7
  Top Layer w0.254: 36.05,27.41 36.84,26.62 36.84,26.06
$1N54448: length 36.6
  Top Layer w0.762: v1(42.52,11.81) 42.57,11.86 D16.1
  内层1 w0.762: v1(12.04,9.02) 39.73,9.02 v1(42.52,11.81)
  Bottom Layer w0.762: v1(12.04,9.02) 10.1,9.02 U2.14

## Copper pours and planes (outline as drawn; the poured copper is in the pictures)
3V3 on Top Layer: 45.7,16.38 47.08,16.38 47.08,11.43 45.7,11.43
5V on Top Layer: 42.25,22.32 49.5,22.32 49.5,17.31 42.25,17.31
10V on Top Layer: 36.17,33.27 39.73,33.27 39.73,29.97 36.17,29.97
10V on 内层1: 10.5,31.62 39.73,31.62 39.73,30.48 10.5,30.48
GND on Top Layer: 21.82,34.92 28.3,34.92 28.3,31.62 21.82,31.62
PGND on Top Layer: 26.01,13.77 27.1,13.77 27.1,11.94 26.01,11.94
PGND on Top Layer: 14.07,13.79 15.11,13.79 15.11,11.96 14.07,11.96
PGND on Top Layer: 21.3,12.93 22.43,12.93 22.43,11.15 21.3,11.15
PGND on Top Layer: 33.84,13.74 34.97,13.74 34.97,11.96 33.84,11.96
PGND on Top Layer: 6.23,14.33 7.32,14.33 7.32,11.94 6.23,11.94
PGND on Top Layer: 2.01,12.95 2.9,12.95 2.9,11.23 2.01,11.23
PGND on Bottom Layer: -0.28,38.93 5.44,38.93 5.44,20.33 38.45,20.33 38.45,-0.32 -0.4,-0.32 -0.4,38.8
VIN on Top Layer: 12.17,38.73 43.15,38.73 43.15,33.02 12.17,33.02
VIN on Top Layer: 2.74,17.65 40.74,17.65 40.74,14.86 2.74,14.86
VIN on Top Layer: 46.08,32 48.74,32 48.74,28.67 46.08,28.67
M0_OUT1_N on Top Layer: 15.85,7.57 20.37,7.57 20.37,0.23 15.85,0.23
M0_OUT1_N on 内层2: 15.85,7.61 20.37,7.61 20.37,0.27 15.85,0.27
M0_OUT1_P on Top Layer: 15.34,14.61 20.06,14.61 20.06,9.27 15.34,9.27
M0_OUT1_P on 内层2: 15.34,14.61 20.07,14.61 20.07,9.27 15.34,9.27
M0_OUT2_N on Top Layer: 7.98,7.8 15.52,7.8 15.52,0.23 7.98,0.23
M0_OUT2_N on 内层2: 8.08,7.85 15.49,7.85 15.49,0.28 8.08,0.28
M0_OUT2_P on Top Layer: 7.59,14.61 12.3,14.61 12.3,9.27 7.59,9.27
M0_OUT2_P on 内层2: 7.67,14.66 12.38,14.66 12.38,9.32 7.67,9.32
M0_OUT3 on Top Layer: 3.17,13.12 11,13.12 11,0.23 3.17,0.23
M0_OUT3 on Top Layer: 2.72,14.63 5.89,14.63 5.89,10.29 2.72,10.29
M0_OUT3 on 内层2: 3.18,13.01 11,13.01 11,0.19 3.18,0.19
M0_OUT3 on 内层2: 2.67,14.65 5.84,14.65 5.84,10.31 2.67,10.31
M1_OUT1_N on Top Layer: 31.88,7.57 37.59,7.57 37.59,0.18 31.88,0.18
M1_OUT1_N on 内层2: 31.91,7.63 37.63,7.63 37.63,0.24 31.91,0.24
M1_OUT1_P on Top Layer: 35.25,14.64 39.95,14.64 39.95,9.16 35.25,9.16
M1_OUT1_P on 内层2: 35.18,14.66 39.88,14.66 39.88,9.18 35.18,9.18
M1_OUT2_N on Top Layer: 26.34,7.87 30.4,7.87 30.4,0.31 26.34,0.31
M1_OUT2_N on 内层2: 26.39,7.78 30.45,7.78 30.45,0.34 26.39,0.34
M1_OUT2_P on Top Layer: 27.35,14.69 32.18,14.69 32.18,9.21 27.35,9.21
M1_OUT2_P on 内层2: 27.37,14.69 32.2,14.69 32.2,9.21 27.37,9.21
M1_OUT3 on Top Layer: 22.21,14.61 25.51,14.61 25.51,10.26 22.21,10.26
M1_OUT3 on Top Layer: 22,12.62 25.55,12.62 25.55,0.33 22,0.33
M1_OUT3 on 内层2: 22.18,14.56 25.48,14.56 25.48,10.22 22.18,10.22
M1_OUT3 on 内层2: 21.95,12.62 25.5,12.62 25.5,0.33 21.95,0.33
$1N3545 on Top Layer: 21.69,36.07 26.14,36.07 26.14,33.66 21.69,33.66
$1N3571 on Top Layer: 7.21,37.08 21.44,37.08 21.44,31.56 7.21,31.56
$1N3819 on Top Layer: 45.99,28.45 50.01,28.45 50.01,22.73 45.99,22.73
$1N5187 on Top Layer: 40.11,35.94 43.41,35.94 43.41,30.8 40.11,30.8
$1N5456 on Top Layer: 44.3,37.97 47.61,37.97 47.61,32.77 44.3,32.77

Small or netless copper shapes (teardrops, artwork), in the pictures only: 1 on Top Layer

## Text on the board
Bottom Silkscreen Layer: (VP)M0_O2_CS | 3V3 | (VN)M0_O1_CS | (22) | SDA_0(19) | (EN) | (34)M1_O2_CS | SDA_1(23) | (35)M1_O1_CS | SCL_0(18) | (32)M0_IN1 | SCL_1(5) | (33)M0_IN2 | TXD(17) | (25)M0_IN3 | RXD(16) | (26)M1_IN1 | Power_ADC(4) | (27)M1_IN2 | (0) | (2) | (14)M1_IN3 | (12)Motor_EN | IO_15 | GND | IO_13 | 灯哥开源 FOC | V3 Plus | M0_A | M1_A
Top Silkscreen Layer: SCL1 SCL0 | SDA1 SDA0 | GND  3V3 | IO15  IO13 | GND GND | 3V3 3V3 | RX   TX | 3V3 5V | GND | EN | -         +
